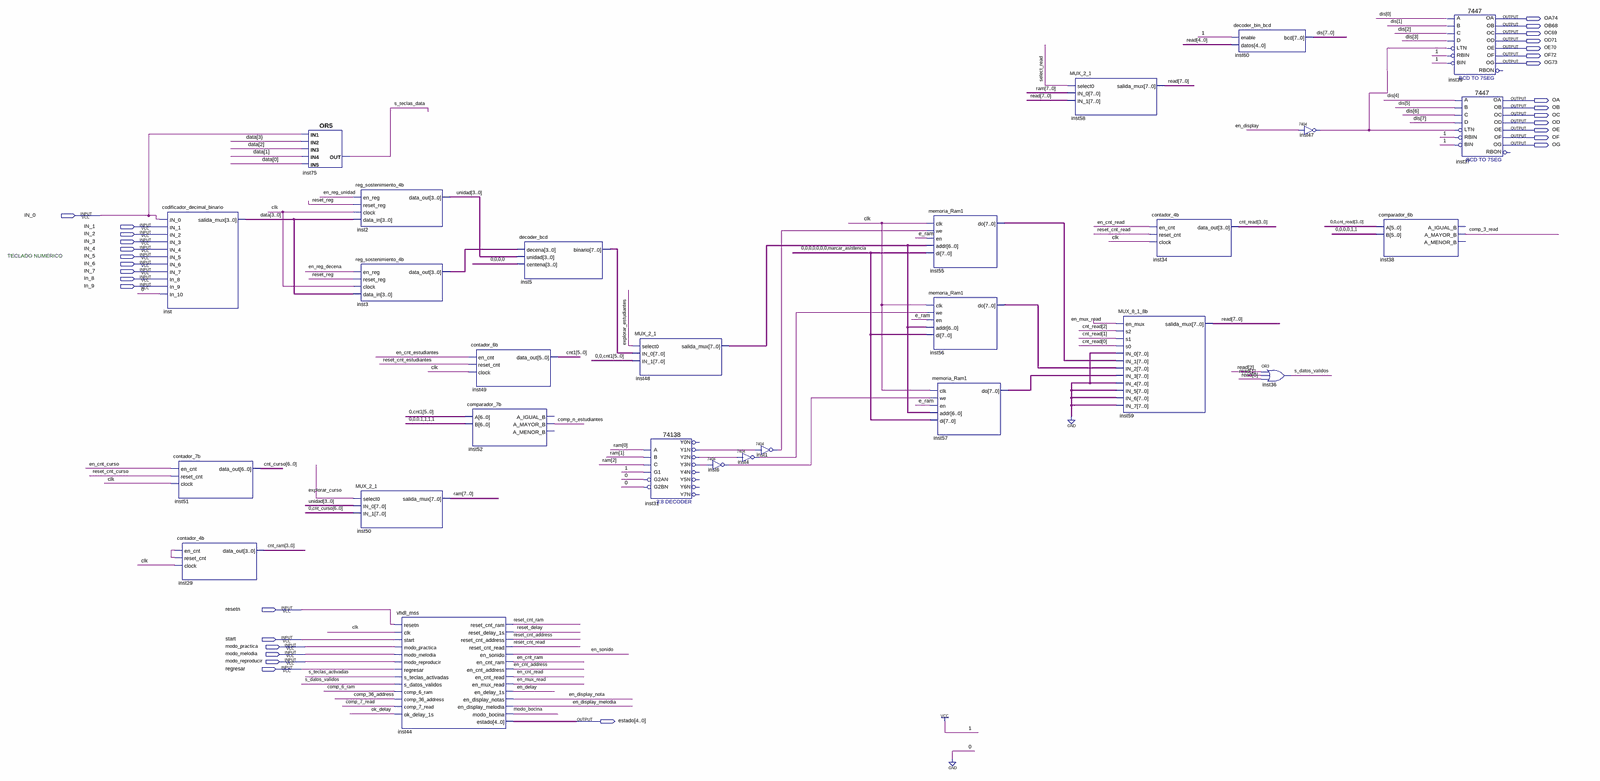
[diagram p0: schematic sheet, whole]
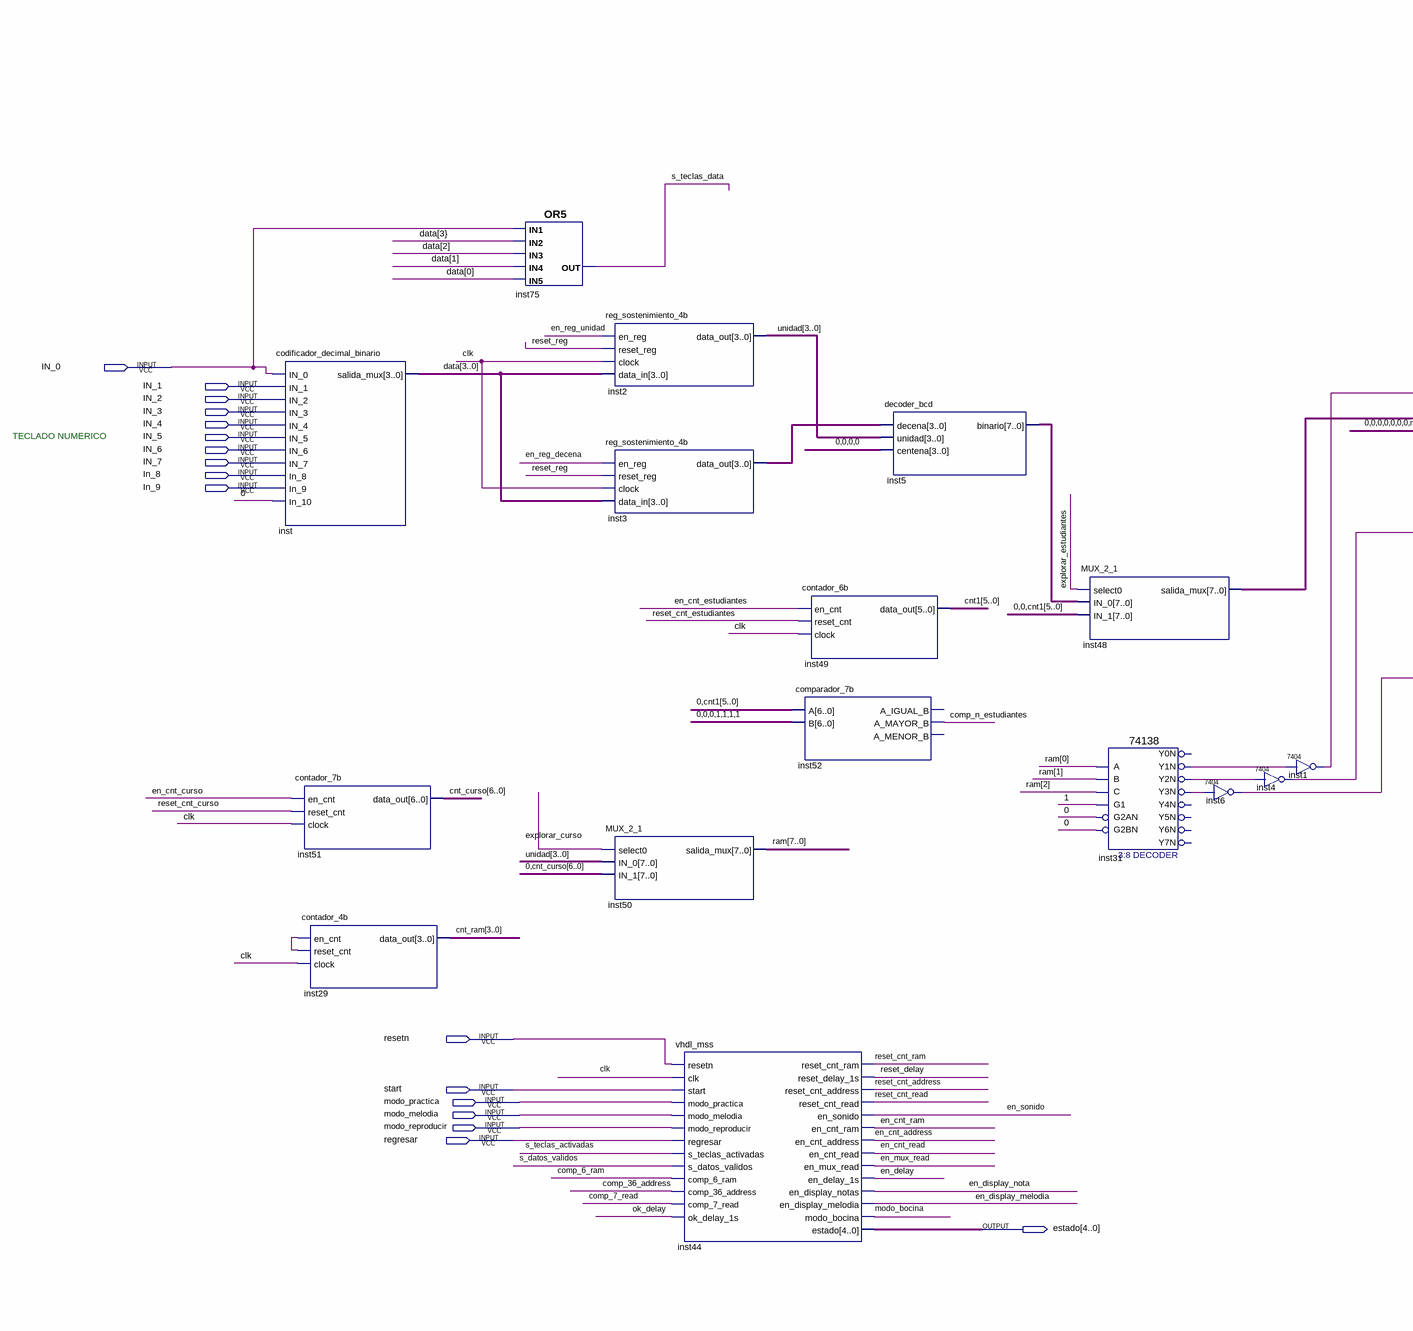
[diagram p1: schematic sheet, left part]
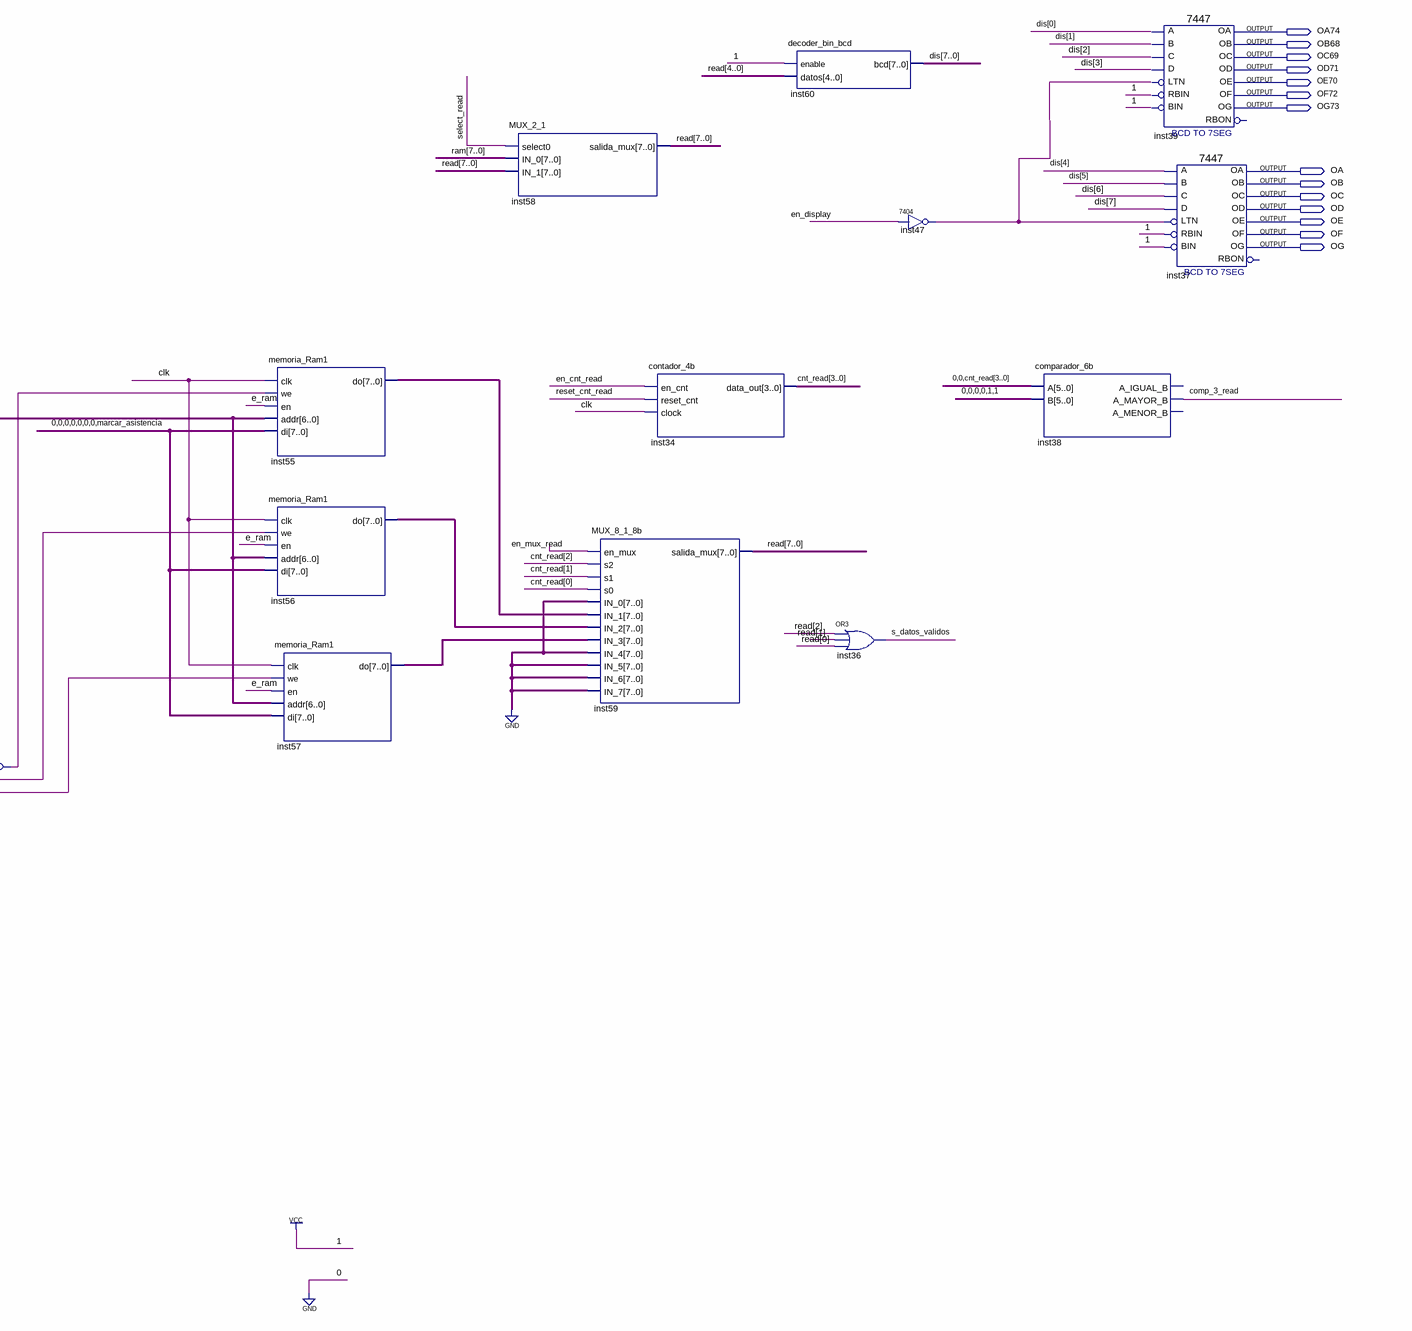
[diagram p2: schematic sheet, right part]
// Quartus schematic estadistica_1.bdf as structural Verilog: 28 symbols, 31 pins
module estadistica_1 (
  input  IN_0,
  input  IN_1,
  input  IN_2,
  input  IN_3,
  input  IN_4,
  input  IN_5,
  input  IN_6,
  input  IN_7,
  input  In_8,
  input  In_9,
  input  resetn,
  input  start,
  input  modo_practica,
  input  modo_melodia,
  input  modo_reproducir,
  input  regresar,
  output OA74,
  output OB68,
  output OC69,
  output OD71,
  output OE70,
  output OF72,
  output OG73,
  output OA,
  output OB,
  output OC,
  output OD,
  output OE,
  output OF,
  output OG,
  output [4:0] estado
);

  wire clk, comp_3_read, comp_6_ram, comp_7_read, comp_36_address, comp_n_estudiantes, \data[3} , e_ram,
       en_cnt_address, en_cnt_curso, en_cnt_estudiantes, en_cnt_ram, en_cnt_read, en_delay, en_display,
       en_display_melodia, en_display_nota, en_mux_read, en_reg_decena, en_reg_unidad, en_sonido,
       explorar_curso, explorar_estudiantes, inst1_1, inst4_1, inst6_1, inst31_y1n, inst31_y2n, inst31_y3n,
       inst47_1, marcar_asistencia, modo_bocina, ok_delay, reset_cnt_address, reset_cnt_curso,
       reset_cnt_estudiantes, reset_cnt_ram, reset_cnt_read, reset_delay, reset_reg, s_datos_validos,
       s_teclas_activadas, s_teclas_data, select_read, undriven;
  wire [3:0] cnt_ram, cnt_read, data, inst3_data_out, unidad;
  wire [5:0] cnt1;
  wire [6:0] cnt_curso;
  wire [7:0] dis, inst5_binario, inst48_salida_mux, inst55_do, inst56_do, inst57_do, ram, read;

  codificador_decimal_binario inst (
    .IN_0(IN_0), .IN_1(IN_1), .IN_2(IN_2), .IN_3(IN_3), .IN_4(IN_4), .IN_5(IN_5), .IN_6(IN_6), .IN_7(IN_7),
    .In_8(In_8), .In_9(In_9), .In_10(1'b0), .salida_mux(data));
  contador_7b inst51 (.en_cnt(en_cnt_curso), .reset_cnt(reset_cnt_curso), .clock(clk), .data_out(cnt_curso));
  contador_4b inst29 (.en_cnt(undriven), .reset_cnt(undriven), .clock(clk), .data_out(cnt_ram));
  or inst75 (s_teclas_data, IN_0, \data[3} , data[2], data[1], data[0]);
  reg_sostenimiento_4b inst2 (
    .en_reg(en_reg_unidad), .reset_reg(reset_reg), .clock(clk), .data_in(data), .data_out(unidad));
  reg_sostenimiento_4b inst3 (
    .en_reg(en_reg_decena), .reset_reg(reset_reg), .clock(clk), .data_in(data), .data_out(inst3_data_out));
  MUX_2_1 inst50 (.select0(explorar_curso), .IN_0(unidad), .IN_1({1'b0, cnt_curso}), .salida_mux(ram));
  vhdl_mss inst44 (
    .resetn(resetn), .clk(clk), .start(start), .modo_practica(modo_practica), .modo_melodia(modo_melodia),
    .modo_reproducir(modo_reproducir), .regresar(regresar), .s_teclas_activadas(s_teclas_activadas),
    .s_datos_validos(s_datos_validos), .comp_6_ram(comp_6_ram), .comp_36_address(comp_36_address),
    .comp_7_read(comp_7_read), .ok_delay_1s(ok_delay), .reset_cnt_ram(reset_cnt_ram),
    .reset_delay_1s(reset_delay), .reset_cnt_address(reset_cnt_address), .reset_cnt_read(reset_cnt_read),
    .en_sonido(en_sonido), .en_cnt_ram(en_cnt_ram), .en_cnt_address(en_cnt_address),
    .en_cnt_read(en_cnt_read), .en_mux_read(en_mux_read), .en_delay_1s(en_delay),
    .en_display_notas(en_display_nota), .en_display_melodia(en_display_melodia), .modo_bocina(modo_bocina),
    .estado(estado));
  contador_6b inst49 (.en_cnt(en_cnt_estudiantes), .reset_cnt(reset_cnt_estudiantes), .clock(clk), .data_out(cnt1));
  comparador_7b inst52 (
    .A({1'b0, cnt1}), .B(7'b0001111), .A_MAYOR_B(comp_n_estudiantes));  // open: A_IGUAL_B, A_MENOR_B
  decoder_bcd inst5 (.decena(inst3_data_out), .unidad(unidad), .centena(4'b0000), .binario(inst5_binario));
  MUX_2_1 inst48 (
    .select0(explorar_estudiantes), .IN_0(inst5_binario), .IN_1({2'b00, cnt1}), .salida_mux(inst48_salida_mux));
  \74138  inst31 (
    .A(ram[0]), .B(ram[1]), .G1(1'b1), .C(ram[2]), .G2AN(1'b0), .G2BN(1'b0), .Y1N(inst31_y1n),
    .Y2N(inst31_y2n), .Y3N(inst31_y3n));  // open: Y0N, Y4N, Y5N, Y6N, Y7N
  \7404  inst6 (.\2 (inst31_y3n), .\1 (inst6_1));
  \7404  inst4 (.\2 (inst31_y2n), .\1 (inst4_1));
  \7404  inst1 (.\2 (inst31_y1n), .\1 (inst1_1));
  memoria_Ram1 inst55 (
    .clk(clk), .we(inst1_1), .en(e_ram), .addr(inst48_salida_mux), .di({{7{1'b0}}, marcar_asistencia}),
    .\do (inst55_do));
  memoria_Ram1 inst56 (
    .clk(clk), .we(inst4_1), .en(e_ram), .addr(inst48_salida_mux), .di({{7{1'b0}}, marcar_asistencia}),
    .\do (inst56_do));
  memoria_Ram1 inst57 (
    .clk(clk), .we(inst6_1), .en(e_ram), .addr(inst48_salida_mux), .di({{7{1'b0}}, marcar_asistencia}),
    .\do (inst57_do));
  MUX_2_1 inst58 (.select0(select_read), .IN_0(ram), .IN_1(read), .salida_mux(read));
  MUX_8_1_8b inst59 (
    .en_mux(en_mux_read), .s2(cnt_read[2]), .s1(cnt_read[1]), .s0(cnt_read[0]), .IN_0({8{1'b0}}),
    .IN_1(inst55_do), .IN_2(inst56_do), .IN_3(inst57_do), .IN_4({8{1'b0}}), .IN_5({8{1'b0}}),
    .IN_6({8{1'b0}}), .IN_7({8{1'b0}}), .salida_mux(read));
  contador_4b inst34 (.en_cnt(en_cnt_read), .reset_cnt(reset_cnt_read), .clock(clk), .data_out(cnt_read));
  decoder_bin_bcd inst60 (.enable(1'b1), .datos(read[4:0]), .bcd(dis));
  or inst36 (s_datos_validos, read[2], read[1], read[0]);
  \7404  inst47 (.\2 (en_display), .\1 (inst47_1));
  comparador_6b inst38 (.A({2'b00, cnt_read}), .B(6'b000011), .A_MAYOR_B(comp_3_read));  // open: A_IGUAL_B, A_MENOR_B
  \7447  inst39 (.OA(OA74));  // open: LTN, B, C, D, RBIN, BIN, A, OB, OC, OE, OD, OF, OG, RBON
  \7447  inst37 (
    .LTN(inst47_1), .B(dis[5]), .C(dis[6]), .D(dis[7]), .RBIN(1'b1), .BIN(1'b1), .A(dis[4]), .OB(OB),
    .OC(OC), .OE(OE), .OD(OD), .OF(OF), .OG(OG), .OA(OA));  // open: RBON

  // Notes on the sheet:
  //   TECLADO NUMERICO
endmodule
